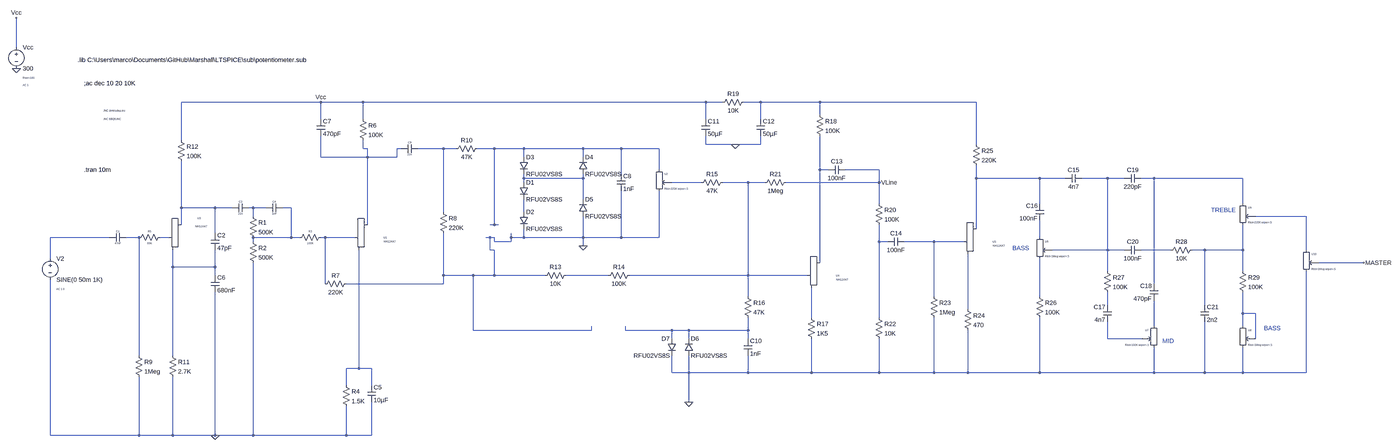
[diagram p0: schematic marshall_jubilee.asc, whole sheet]
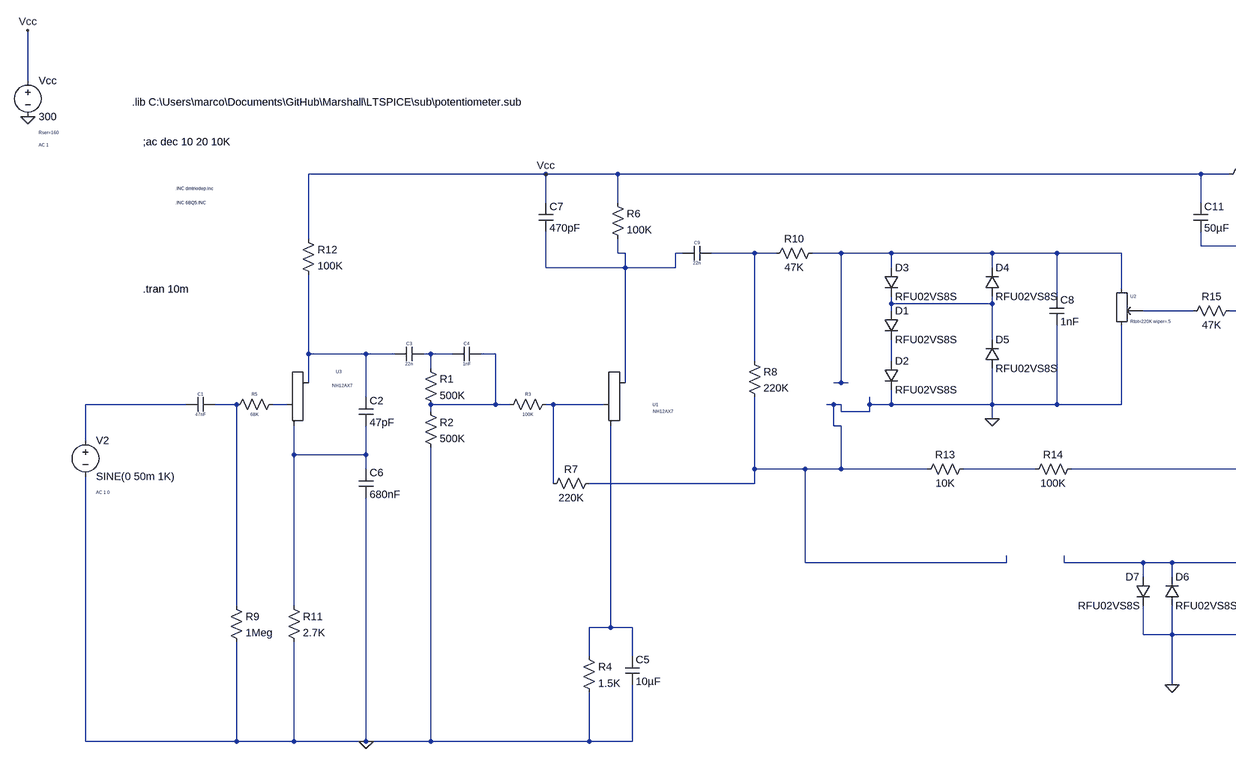
[diagram p1: schematic marshall_jubilee.asc, part, row 1 of 1, column 1 of 2]
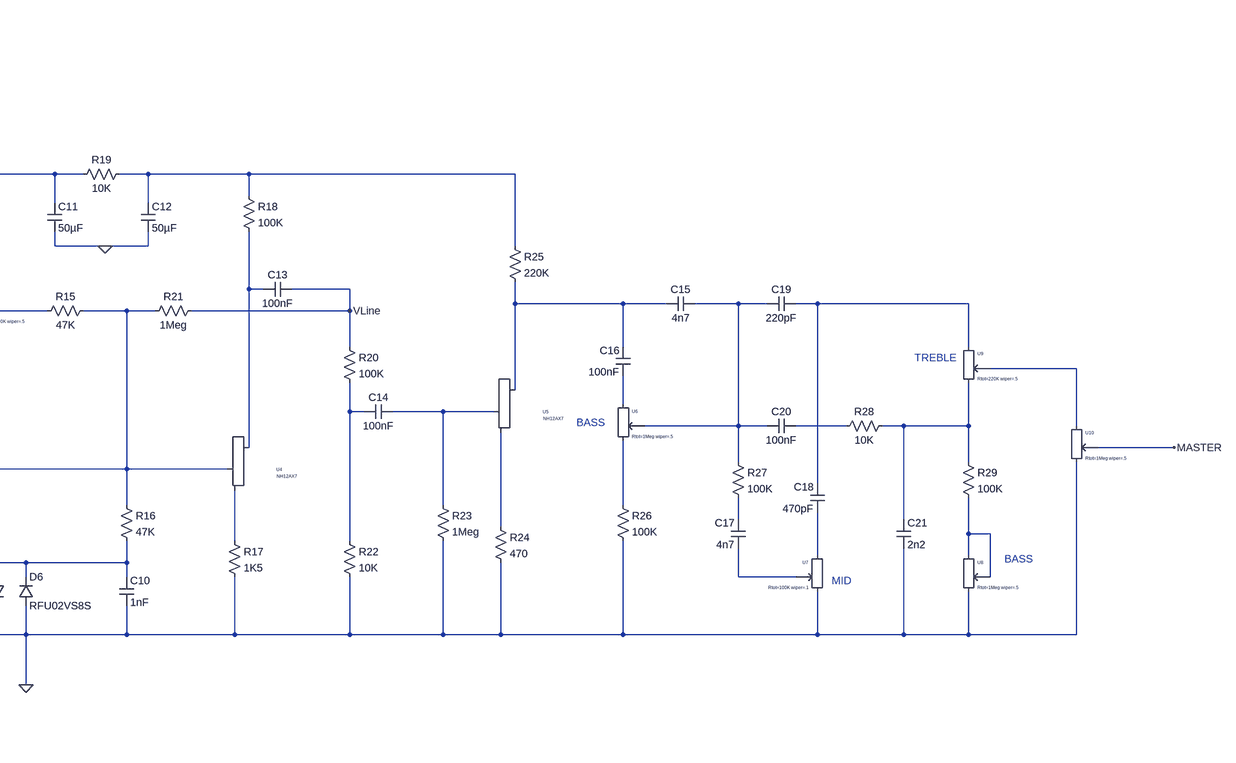
[diagram p2: schematic marshall_jubilee.asc, part, row 1 of 1, column 2 of 2]
marshall_jubilee.asc, the LTspice schematic file:
Version 4
SHEET 1 3792 948
WIRE -1424 -560 -1424 -672
WIRE -272 -352 -800 -352
WIRE -112 -352 -272 -352
WIRE 1184 -352 -112 -352
WIRE 1248 -352 1184 -352
WIRE 1392 -352 1328 -352
WIRE 1616 -352 1392 -352
WIRE 2208 -352 1616 -352
WIRE 1616 -304 1616 -352
WIRE -272 -288 -272 -352
WIRE -112 -288 -112 -352
WIRE 1184 -288 1184 -352
WIRE 1392 -288 1392 -352
WIRE -800 -208 -800 -352
WIRE 1184 -192 1184 -224
WIRE 1296 -192 1184 -192
WIRE 1392 -192 1392 -224
WIRE 1392 -192 1296 -192
WIRE 2208 -192 2208 -352
WIRE -112 -176 -112 -208
WIRE -96 -176 -112 -176
WIRE 32 -176 16 -176
WIRE 192 -176 96 -176
WIRE 240 -176 192 -176
WIRE 384 -176 320 -176
WIRE 496 -176 384 -176
WIRE 720 -176 496 -176
WIRE 864 -176 720 -176
WIRE 1008 -176 864 -176
WIRE -272 -144 -272 -224
WIRE -96 -144 -96 -176
WIRE -96 -144 -272 -144
WIRE 16 -144 16 -176
WIRE 16 -144 -96 -144
WIRE 496 -144 496 -176
WIRE 720 -144 720 -176
WIRE 1008 -96 1008 -176
WIRE 1616 -96 1616 -224
WIRE 1648 -96 1616 -96
WIRE 1840 -96 1712 -96
WIRE 864 -80 864 -176
WIRE 496 -64 496 -80
WIRE 720 -64 720 -80
WIRE 720 -64 496 -64
WIRE 2208 -64 2208 -112
WIRE 2448 -64 2208 -64
WIRE 2544 -64 2448 -64
WIRE 2704 -64 2608 -64
WIRE 2768 -64 2704 -64
WIRE 2880 -64 2832 -64
WIRE 3216 -64 2880 -64
WIRE 496 -48 496 -64
WIRE 1168 -48 1056 -48
WIRE 1344 -48 1248 -48
WIRE 1408 -48 1344 -48
WIRE 1840 -48 1840 -96
WIRE 1840 -48 1488 -48
WIRE 720 16 720 -64
WIRE 1840 32 1840 -48
WIRE 2448 32 2448 -64
WIRE 3216 32 3216 -64
WIRE -800 48 -800 -128
WIRE -672 48 -800 48
WIRE -608 48 -672 48
WIRE -528 48 -544 48
WIRE -480 48 -528 48
WIRE -384 48 -416 48
WIRE 192 64 192 -176
WIRE 496 64 496 16
WIRE -528 80 -528 48
WIRE 3456 80 3264 80
WIRE -800 112 -800 48
WIRE -96 112 -96 -144
WIRE 384 112 384 -176
WIRE 384 112 368 112
WIRE 400 112 384 112
WIRE 2208 128 2208 -64
WIRE -672 144 -672 48
WIRE -1072 160 -1296 160
WIRE -960 160 -1008 160
WIRE -848 160 -880 160
WIRE -384 160 -384 48
WIRE -384 160 -528 160
WIRE -352 160 -384 160
WIRE -256 160 -272 160
WIRE -144 160 -256 160
WIRE 368 160 352 160
WIRE 384 160 368 160
WIRE 448 160 448 144
WIRE 496 160 496 128
WIRE 496 160 448 160
WIRE 720 160 720 80
WIRE 720 160 496 160
WIRE 864 160 864 -16
WIRE 864 160 720 160
WIRE 1008 160 1008 -16
WIRE 1008 160 864 160
WIRE 2448 160 2448 96
WIRE -528 176 -528 160
WIRE 384 176 384 160
WIRE 448 176 448 160
WIRE 448 176 384 176
WIRE 1840 176 1840 112
WIRE 1872 176 1840 176
WIRE 2048 176 1936 176
WIRE 2160 176 2048 176
WIRE 720 192 720 160
WIRE 368 208 368 160
WIRE 384 208 368 208
WIRE 2704 208 2704 -64
WIRE 2704 208 2496 208
WIRE 2768 208 2704 208
WIRE 2944 208 2832 208
WIRE 3072 208 3024 208
WIRE 3216 208 3216 112
WIRE 3216 208 3072 208
WIRE 3456 208 3456 80
WIRE -1296 240 -1296 160
WIRE 1616 256 1616 -96
WIRE 3680 256 3504 256
WIRE -832 272 -832 208
WIRE -672 272 -672 208
WIRE -672 272 -832 272
WIRE 2704 288 2704 208
WIRE 3216 288 3216 208
WIRE -672 304 -672 272
WIRE 192 304 192 144
WIRE 304 304 192 304
WIRE 384 304 384 208
WIRE 384 304 304 304
WIRE 576 304 384 304
WIRE 816 304 656 304
WIRE 1344 304 1344 -48
WIRE 1344 304 896 304
WIRE 1568 304 1344 304
WIRE -256 336 -256 160
WIRE 192 336 192 304
WIRE 192 336 -176 336
WIRE 2880 336 2880 -64
WIRE 1344 384 1344 304
WIRE 2048 384 2048 176
WIRE 2448 384 2448 240
WIRE 2704 416 2704 368
WIRE 3072 416 3072 208
WIRE 2176 432 2176 224
WIRE 3216 448 3216 368
WIRE 3264 448 3216 448
WIRE 1584 464 1584 352
WIRE 1840 464 1840 176
WIRE 2880 496 2880 400
WIRE 3216 496 3216 448
WIRE 304 512 304 304
WIRE 752 512 752 496
WIRE 752 512 304 512
WIRE 880 512 880 496
WIRE 1056 512 880 512
WIRE 1120 512 1056 512
WIRE 1344 512 1344 464
WIRE 1344 512 1120 512
WIRE 1056 544 1056 512
WIRE 1120 544 1120 512
WIRE 1344 544 1344 512
WIRE 2704 544 2704 480
WIRE 2832 544 2704 544
WIRE 3264 544 3264 448
WIRE -960 608 -960 160
WIRE -832 608 -832 272
WIRE -128 656 -128 208
WIRE -128 656 -176 656
WIRE -80 656 -128 656
WIRE 1056 672 1056 608
WIRE 1120 672 1120 608
WIRE 1120 672 1056 672
WIRE 1344 672 1344 608
WIRE 1344 672 1120 672
WIRE 1584 672 1584 544
WIRE 1584 672 1344 672
WIRE 1840 672 1840 544
WIRE 1840 672 1584 672
WIRE 2048 672 2048 464
WIRE 2048 672 1840 672
WIRE 2176 672 2176 512
WIRE 2176 672 2048 672
WIRE 2448 672 2448 464
WIRE 2448 672 2176 672
WIRE 2880 672 2880 576
WIRE 2880 672 2448 672
WIRE 3072 672 3072 480
WIRE 3072 672 2880 672
WIRE 3216 672 3216 576
WIRE 3216 672 3072 672
WIRE 3456 672 3456 288
WIRE 3456 672 3216 672
WIRE -176 720 -176 656
WIRE -80 720 -80 656
WIRE 1120 784 1120 672
WIRE -1296 928 -1296 320
WIRE -960 928 -960 688
WIRE -960 928 -1296 928
WIRE -832 928 -832 688
WIRE -832 928 -960 928
WIRE -672 928 -672 368
WIRE -672 928 -832 928
WIRE -528 928 -528 256
WIRE -528 928 -672 928
WIRE -176 928 -176 800
WIRE -176 928 -528 928
WIRE -80 928 -80 784
WIRE -80 928 -176 928
FLAG 1120 784 0
FLAG -672 928 0
FLAG 1296 -192 0
FLAG -272 -352 Vcc
FLAG -1424 -672 Vcc
FLAG -1424 -480 0
FLAG 1840 -48 VLine
FLAG 720 192 0
FLAG 3680 256 MASTER
DATAFLAG -176 -352 ""
DATAFLAG -800 -48 ""
DATAFLAG -832 400 ""
DATAFLAG -96 0 ""
DATAFLAG -128 512 ""
DATAFLAG 1584 416 ""
DATAFLAG 1616 176 ""
DATAFLAG 1936 -352 ""
DATAFLAG 2208 48 ""
SYMBOL voltage -1424 -576 R0
WINDOW 123 24 160 Left 0
WINDOW 39 24 132 Left 0
SYMATTR Value2 AC 1
SYMATTR SpiceLine Rser=160
SYMATTR InstName Vcc
SYMATTR Value 300
SYMBOL voltage -1296 224 R0
WINDOW 123 24 132 Left 0
WINDOW 39 0 0 Left 0
SYMATTR Value2 AC 1 0
SYMATTR InstName V2
SYMATTR Value SINE(0 50m 1K)
SYMBOL res -976 592 R0
SYMATTR InstName R9
SYMATTR Value 1Meg
SYMBOL triode -800 160 R0
WINDOW 0 61 -72 Left 0
WINDOW 3 61 -16 Invisible 0
WINDOW 38 53 -41 Left 0
SYMATTR InstName U3
SYMATTR Value ""
SYMATTR SpiceModel NH12AX7
SYMBOL res -848 592 R0
SYMATTR InstName R11
SYMATTR Value 2.7K
SYMBOL res -816 -224 R0
SYMATTR InstName R12
SYMATTR Value 100K
SYMBOL cap -1072 176 R270
WINDOW 0 32 32 VTop 0
WINDOW 3 0 32 VBottom 0
SYMATTR InstName C1
SYMATTR Value 47nF
SYMBOL cap -688 144 R0
SYMATTR InstName C2
SYMATTR Value 47pF
SYMBOL cap -608 64 R270
WINDOW 0 32 32 VTop 0
WINDOW 3 0 32 VBottom 0
SYMATTR InstName C3
SYMATTR Value 22n
SYMBOL cap -480 64 R270
WINDOW 0 32 32 VTop 0
WINDOW 3 0 32 VBottom 0
SYMATTR InstName C4
SYMATTR Value 1nF
SYMBOL res -544 64 R0
SYMATTR InstName R1
SYMATTR Value 500K
SYMBOL res -544 160 R0
SYMATTR InstName R2
SYMATTR Value 500K
SYMBOL res -368 176 R270
WINDOW 0 32 56 VTop 0
WINDOW 3 0 56 VBottom 0
SYMATTR InstName R3
SYMATTR Value 100K
SYMBOL triode -96 160 R0
WINDOW 0 61 1 Left 0
WINDOW 3 61 -16 Invisible 0
WINDOW 38 62 16 Left 0
SYMATTR InstName U1
SYMATTR Value ""
SYMATTR SpiceModel NH12AX7
SYMBOL res -192 704 R0
SYMATTR InstName R4
SYMATTR Value 1.5K
SYMBOL cap -96 720 R0
SYMATTR InstName C5
SYMATTR Value 10µF
SYMBOL cap -688 304 R0
SYMATTR InstName C6
SYMATTR Value 680nF
SYMBOL res -976 176 R270
WINDOW 0 32 56 VTop 0
WINDOW 3 0 56 VBottom 0
SYMATTR InstName R5
SYMATTR Value 68K
SYMBOL res -128 -304 R0
SYMATTR InstName R6
SYMATTR Value 100K
SYMBOL cap -288 -288 R0
SYMATTR InstName C7
SYMATTR Value 470pF
SYMBOL cap 32 -160 R270
WINDOW 0 32 32 VTop 0
WINDOW 3 0 32 VBottom 0
SYMATTR InstName C9
SYMATTR Value 22n
SYMBOL res -160 320 R90
WINDOW 0 0 56 VBottom 2
WINDOW 3 32 56 VTop 2
SYMATTR InstName R7
SYMATTR Value 220K
SYMBOL res 176 48 R0
SYMATTR InstName R8
SYMATTR Value 220K
SYMBOL res 336 -192 R90
WINDOW 0 0 56 VBottom 2
WINDOW 3 32 56 VTop 2
SYMATTR InstName R10
SYMATTR Value 47K
SYMBOL diode 480 -48 R0
SYMATTR InstName D1
SYMATTR Value RFU02VS8S
SYMBOL diode 480 64 R0
SYMATTR InstName D2
SYMATTR Value RFU02VS8S
SYMBOL diode 480 -144 R0
SYMATTR InstName D3
SYMATTR Value RFU02VS8S
SYMBOL diode 704 -80 M180
WINDOW 0 24 64 Left 2
WINDOW 3 24 0 Left 2
SYMATTR InstName D4
SYMATTR Value RFU02VS8S
SYMBOL diode 704 80 M180
WINDOW 0 24 64 Left 2
WINDOW 3 24 0 Left 2
SYMATTR InstName D5
SYMATTR Value RFU02VS8S
SYMBOL cap 848 -80 R0
SYMATTR InstName C8
SYMATTR Value 1nF
SYMBOL res 672 288 R90
WINDOW 0 0 56 VBottom 2
WINDOW 3 32 56 VTop 2
SYMATTR InstName R13
SYMATTR Value 10K
SYMBOL res 912 288 R90
WINDOW 0 0 56 VBottom 2
WINDOW 3 32 56 VTop 2
SYMATTR InstName R14
SYMATTR Value 100K
SYMBOL potentiometerEU 992 -112 R0
SYMATTR InstName U2
SYMATTR Value Rtot=220K wiper=.5
SYMBOL res 1264 -64 R90
WINDOW 0 0 56 VBottom 2
WINDOW 3 32 56 VTop 2
SYMATTR InstName R15
SYMATTR Value 47K
SYMBOL res 1328 368 R0
SYMATTR InstName R16
SYMATTR Value 47K
SYMBOL diode 1104 608 M180
WINDOW 0 24 64 Left 2
WINDOW 3 24 0 Left 2
SYMATTR InstName D6
SYMATTR Value RFU02VS8S
SYMBOL diode 1072 544 M0
SYMATTR InstName D7
SYMATTR Value RFU02VS8S
SYMBOL cap 1328 544 R0
SYMATTR InstName C10
SYMATTR Value 1nF
SYMBOL triode 1616 304 R0
WINDOW 0 61 1 Left 0
WINDOW 3 61 -16 Invisible 0
WINDOW 38 62 16 Left 0
SYMATTR InstName U4
SYMATTR Value ""
SYMATTR SpiceModel NH12AX7
SYMBOL res 1568 448 R0
SYMATTR InstName R17
SYMATTR Value 1K5
SYMBOL res 1600 -320 R0
SYMATTR InstName R18
SYMATTR Value 100K
SYMBOL cap 1168 -288 R0
SYMATTR InstName C11
SYMATTR Value 50µF
SYMBOL cap 1376 -288 R0
SYMATTR InstName C12
SYMATTR Value 50µF
SYMBOL res 1344 -368 R90
WINDOW 0 0 56 VBottom 2
WINDOW 3 32 56 VTop 2
SYMATTR InstName R19
SYMATTR Value 10K
SYMBOL cap 1712 -112 R90
WINDOW 0 0 32 VBottom 2
WINDOW 3 32 32 VTop 2
SYMATTR InstName C13
SYMATTR Value 100nF
SYMBOL res 1824 16 R0
SYMATTR InstName R20
SYMATTR Value 100K
SYMBOL res 1504 -64 R90
WINDOW 0 0 56 VBottom 2
WINDOW 3 32 56 VTop 2
SYMATTR InstName R21
SYMATTR Value 1Meg
SYMBOL res 1824 448 R0
SYMATTR InstName R22
SYMATTR Value 10K
SYMBOL triode 2208 176 R0
WINDOW 0 61 1 Left 0
WINDOW 3 61 -16 Invisible 0
WINDOW 38 62 16 Left 0
SYMATTR InstName U5
SYMATTR Value ""
SYMATTR SpiceModel NH12AX7
SYMBOL cap 1936 160 R90
WINDOW 0 0 32 VBottom 2
WINDOW 3 32 32 VTop 2
SYMATTR InstName C14
SYMATTR Value 100nF
SYMBOL res 2032 368 R0
SYMATTR InstName R23
SYMATTR Value 1Meg
SYMBOL res 2160 416 R0
SYMATTR InstName R24
SYMATTR Value 470
SYMBOL res 2192 -208 R0
SYMATTR InstName R25
SYMATTR Value 220K
SYMBOL cap 2608 -80 R90
WINDOW 0 0 32 VBottom 2
WINDOW 3 32 32 VTop 2
SYMATTR InstName C15
SYMATTR Value 4n7
SYMBOL cap 2464 96 R180
WINDOW 0 24 56 Left 2
WINDOW 3 24 8 Left 2
SYMATTR InstName C16
SYMATTR Value 100nF
SYMBOL potentiometerEU 2432 144 R0
SYMATTR InstName U6
SYMATTR Value Rtot=1Meg wiper=.5
SYMBOL res 2432 368 R0
SYMATTR InstName R26
SYMATTR Value 100K
SYMBOL res 2688 272 R0
SYMATTR InstName R27
SYMATTR Value 100K
SYMBOL cap 2720 480 R180
WINDOW 0 24 56 Left 2
WINDOW 3 24 8 Left 2
SYMATTR InstName C17
SYMATTR Value 4n7
SYMBOL potentiometerEU 2896 480 M0
SYMATTR InstName U7
SYMATTR Value Rtot=100K wiper=.1
SYMBOL cap 2896 400 R180
WINDOW 0 24 56 Left 2
WINDOW 3 24 8 Left 2
SYMATTR InstName C18
SYMATTR Value 470pF
SYMBOL cap 2832 -80 R90
WINDOW 0 0 32 VBottom 2
WINDOW 3 32 32 VTop 2
SYMATTR InstName C19
SYMATTR Value 220pF
SYMBOL cap 2832 192 R90
WINDOW 0 0 32 VBottom 2
WINDOW 3 32 32 VTop 2
SYMATTR InstName C20
SYMATTR Value 100nF
SYMBOL res 3040 192 R90
WINDOW 0 0 56 VBottom 2
WINDOW 3 32 56 VTop 2
SYMATTR InstName R28
SYMATTR Value 10K
SYMBOL cap 3056 416 R0
SYMATTR InstName C21
SYMATTR Value 2n2
SYMBOL res 3200 272 R0
SYMATTR InstName R29
SYMATTR Value 100K
SYMBOL potentiometerEU 3200 480 R0
SYMATTR InstName U8
SYMATTR Value Rtot=1Meg wiper=.5
SYMBOL potentiometerEU 3200 16 R0
SYMATTR InstName U9
SYMATTR Value Rtot=220K wiper=.5
SYMBOL potentiometerEU 3440 192 R0
SYMATTR InstName U10
SYMATTR Value Rtot=1Meg wiper=.5
TEXT -1096 -288 Left 0 !.INC 6BQ5.INC
TEXT -1096 -320 Left 0 !.INC dmtriodep.inc
TEXT -1168 -424 Left 2 !;ac dec 10 20 10K
TEXT -1192 -512 Left 2 !.lib C:\\Users\\marco\\Documents\\GitHub\\Marshall\\LTSPICE\\sub\\potentiometer.sub
TEXT -1168 -96 Left 2 !.tran 10m
TEXT 3096 56 Left 2 ;TREBLE
TEXT 2912 552 Left 2 ;MID
TEXT 3296 504 Left 2 ;BASS
TEXT 2344 200 Left 2 ;BASS

The netlist it stands for:
* marshall_jubilee.asc
Vcc Vcc 0 300 AC 1 Rser=160
V2 N017 0 SINE(0 50m 1K) AC 1 0
R9 N018 0 1Meg
XU3 N012 N019 N026 NH12AX7
R11 N026 0 2.7K
R12 Vcc N012 100K
C1 N017 N018 47nF
C2 N012 N026 47pF
C3 N012 N013 22n
C4 N013 N014 1nF
R1 N013 N014 500K
R2 N014 0 500K
R3 N014 N020 100K
XU1 N002 N020 N036 NH12AX7
R4 N036 0 1.5K
C5 N036 0 10µF
C6 N026 0 680nF
R5 N018 N019 68K
R6 Vcc N002 100K
C7 Vcc N002 470pF
C9 N002 N003 22n
R7 0 N020 220K
R8 N003 0 220K
R10 N004 N003 47K
D1 N006 N015 RFU02VS8S
D2 N015 0 RFU02VS8S
D3 N004 N006 RFU02VS8S
D4 N006 N004 RFU02VS8S
D5 0 N006 RFU02VS8S
C8 N004 0 1nF
R13 N027 0 10K
R14 N011 N027 100K
XU2 N004 0 N010 potentiometer Rtot=220K wiper=.5  ; pins A B C
R15 N011 N010 47K
R16 N011 N034 47K
D6 0 N034 RFU02VS8S
D7 N034 0 RFU02VS8S
C10 N034 0 1nF
XU4 N005 N011 N032 NH12AX7
R17 N032 0 1K5
R18 N001 N005 100K
C11 Vcc 0 50µF
C12 N001 0 50µF
R19 N001 Vcc 10K
C13 VLine N005 100nF
R20 VLine N022 100K
R21 VLine N011 1Meg
R22 N022 0 10K
XU5 N007 N023 N030 NH12AX7
C14 N023 N022 100nF
R23 N023 0 1Meg
R24 N030 0 470
R25 N001 N007 220K
C15 N008 N007 4n7
C16 N021 N007 100nF
XU6 N021 N028 N008 potentiometer Rtot=1Meg wiper=.5  ; pins A B C
R26 N028 0 100K
R27 N008 N029 100K
C17 N035 N029 4n7
XU7 N033 0 N035 potentiometer Rtot=100K wiper=.1  ; pins A B C
C18 N033 N009 470pF
C19 N009 N008 220pF
C20 N024 N008 100nF
R28 N025 N024 10K
C21 N025 0 2n2
R29 N025 N031 100K
XU8 N031 0 N031 potentiometer Rtot=1Meg wiper=.5  ; pins A B C
XU9 N009 N025 N016 potentiometer Rtot=220K wiper=.5  ; pins A B C
XU10 N016 0 MASTER potentiometer Rtot=1Meg wiper=.5  ; pins A B C
.model D D
.lib standard.dio
.INC 6BQ5.INC
.INC dmtriodep.inc
;ac dec 10 20 10K
.lib C:\Users\marco\Documents\GitHub\Marshall\LTSPICE\sub\potentiometer.sub
.tran 10m
* TREBLE
* MID
* BASS
* BASS
.backanno
.end